# Altium project Sensor.PrjPcb
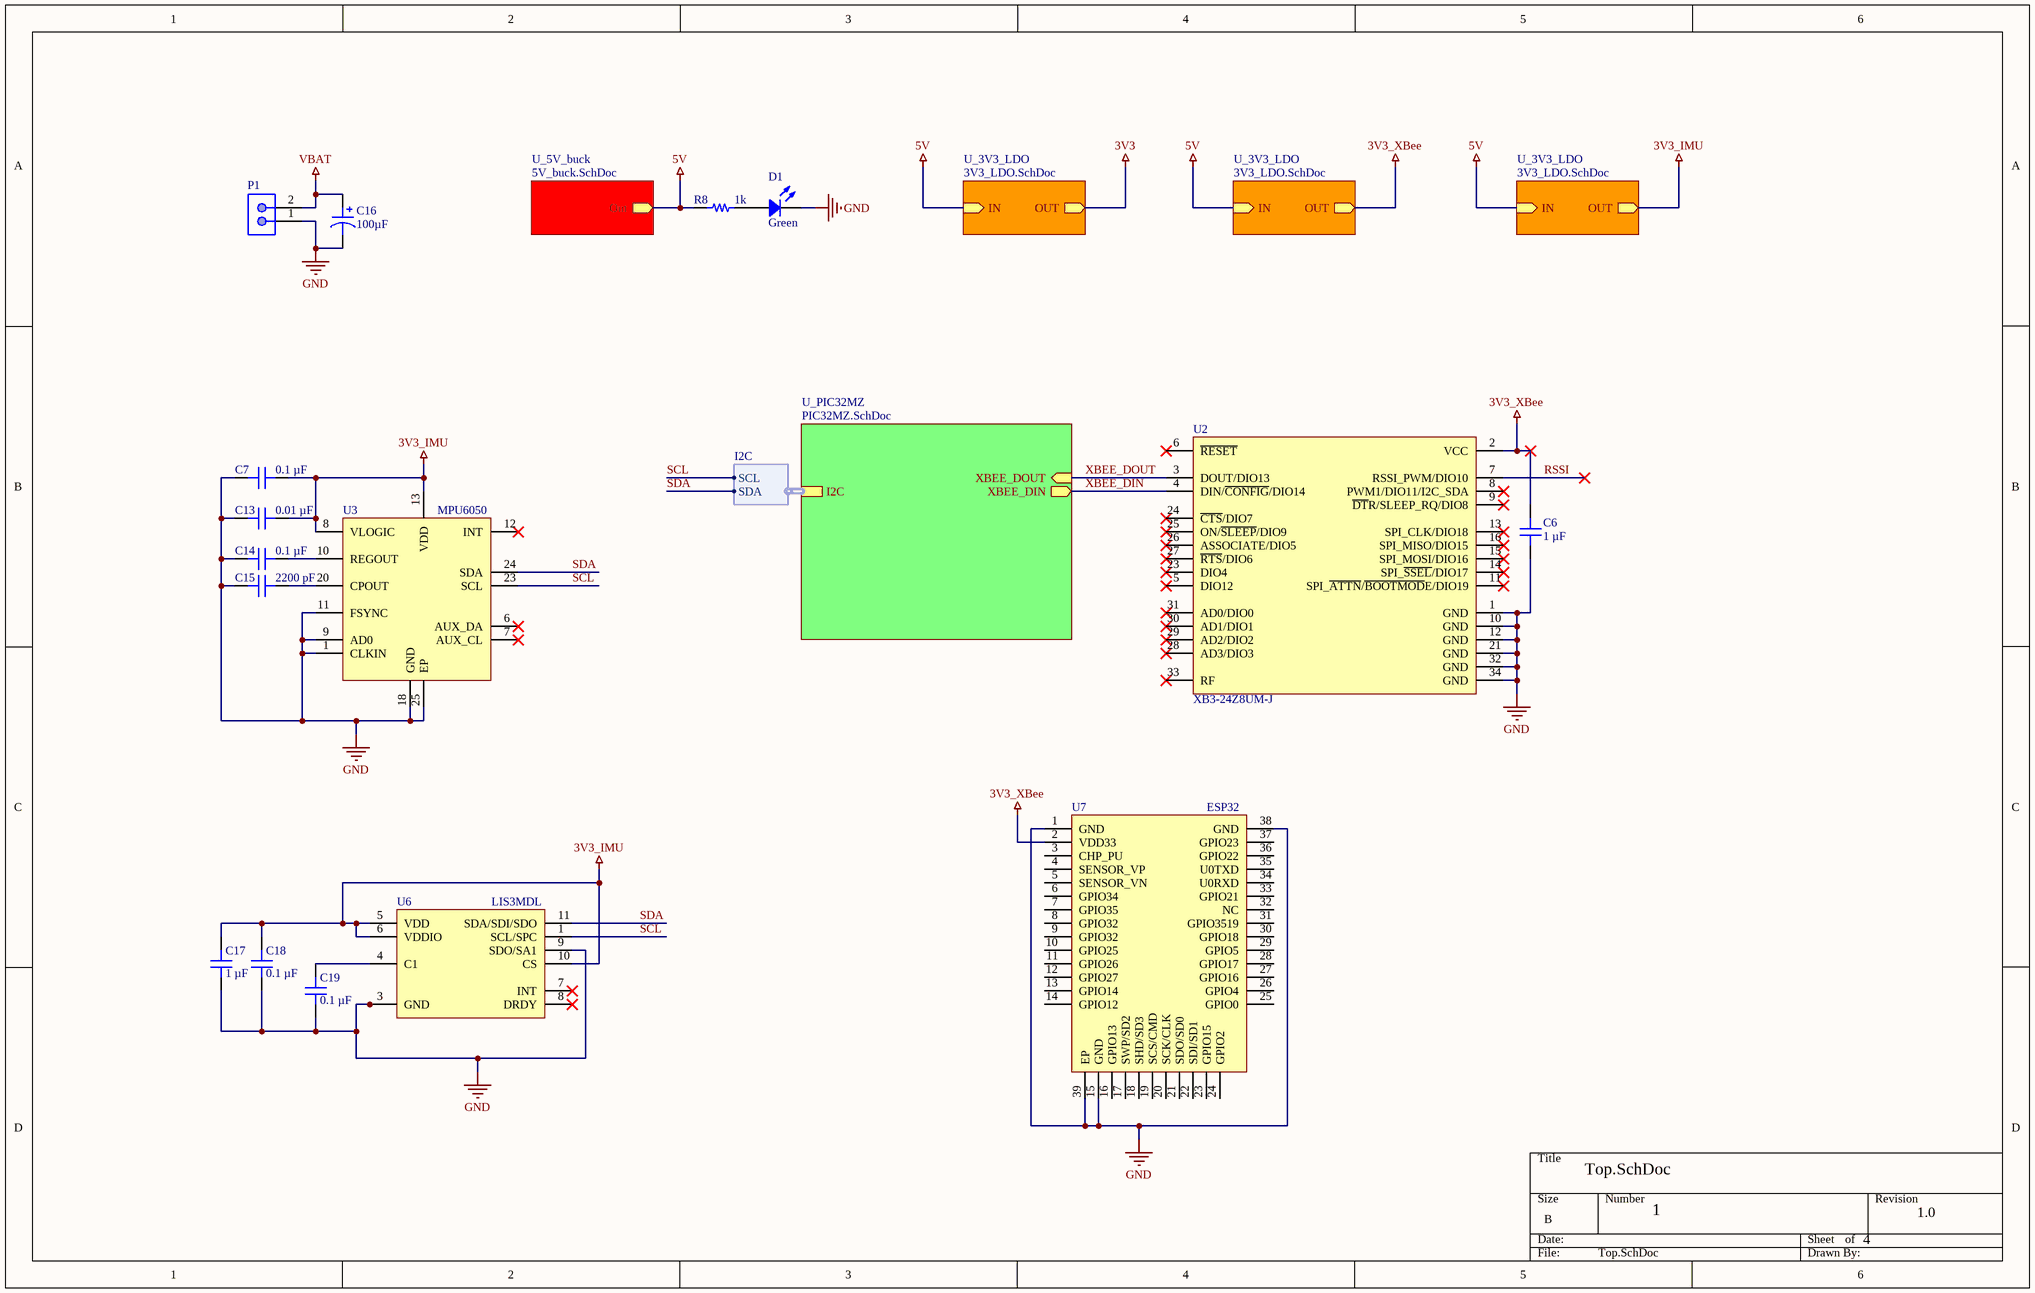
[diagram p0: Top.SchDoc]
ProjectRevision: 1.0
4 sheets, 57 parts. Net scope: hierarchical (ports join the sheet entries above them; power ports are global).
Board file: Sensor.PcbDoc
Sheets:
  Top.SchDoc
    U_PIC32MZ = PIC32MZ.SchDoc
    U_5V_buck = 5V_buck.SchDoc
    U_3V3_LDO = 3V3_LDO.SchDoc
    U_3V3_LDO = 3V3_LDO.SchDoc
    U_3V3_LDO = 3V3_LDO.SchDoc

## Sheet Top.SchDoc
size B; SheetNumber: 1; SheetTotal: 4

### Parts
C6  1 µF  [CAP 0402_1005]
C7  0.1 µF  [CAP 0402_1005]
C13  0.01 µF  [CAP 0402_1005]
C14  0.1 µF  [CAP 0402_1005]
C15  2200 pF  [CAP 0402_1005]
C16  100µF  [CAP POL 2917_7343]
C17  1 µF  [CAP 0402_1005]
C18  0.1 µF  [CAP 0402_1005]
C19  0.1 µF  [CAP 0402_1005]
D1  Green  [LED 0603_1608 GREEN]
P1  2 pin 2mm JST Male  [2pin - 2mm JST male]  (value not drawn)
R8  1k  [RES 0402_1005]
U2  XB3-24Z8UM-J  [XCVR_XB3-24Z8UM-J]
U3  MPU6050  [IC_MPU6050]
U6  LIS3MDL  [LGA12_ST]
U7  ESP32  [Espressif ESP32-WROOM-32]

### Sub-sheets
U_3V3_LDO = 3V3_LDO.SchDoc: OUT (out), IN (in)
U_3V3_LDO = 3V3_LDO.SchDoc: OUT (out), IN (in)
U_3V3_LDO = 3V3_LDO.SchDoc: OUT (out), IN (in)
U_5V_buck = 5V_buck.SchDoc: Out (out)
U_PIC32MZ = PIC32MZ.SchDoc: XBEE_DIN (out), XBEE_DOUT (in), I2C (harness I2C)

### Harnesses
I2C: SCL, SDA

### Nets
3V3_IMU: C7.1 C13.1 C17.1 C18.1 U3.8(VLOGIC) U3.13(VDD) U6.5(VDD) U6.6(VDDIO) U6.10(CS) ; sheet U_3V3_LDO/OUT
3V3_XBee: C6.1 U2.2(VCC) U7.2(VDD33) ; sheet U_3V3_LDO/OUT
5V: R8.1 ; sheet U_5V_buck/Out, sheet U_3V3_LDO/IN, sheet U_3V3_LDO/IN, sheet U_3V3_LDO/IN
GND: C6.2 C7.2 C13.2 C14.2 C15.2 C16.2 C17.2 C18.2 C19.2 D1.2 P1.1 U2.1(GND) U2.10(GND) U2.12(GND) U2.21(GND) U2.32(GND) U2.34(GND) U3.1(CLKIN) U3.9(AD0) U3.11(FSYNC) U3.18(GND) U3.25(EP) U6.2(Reserved) U6.3(GND) U6.9(SDO/SA1) U6.12(Reserved) U7.1(GND) U7.15(GND) U7.38(GND) U7.39(EP)
VBAT: C16.1 P1.2
RSSI: U2.7(RSSI_PWM/DIO10)
SCL: U3.23(SCL) U6.1(SCL/SPC) ; sheet U_PIC32MZ/I2C.SCL
SDA: U3.24(SDA) U6.11(SDA/SDI/SDO) ; sheet U_PIC32MZ/I2C.SDA
XBEE_DIN: U2.4(DIN/~{CONFIG}/DIO14) ; sheet U_PIC32MZ/XBEE_DIN
XBEE_DOUT: U2.3(DOUT/DIO13) ; sheet U_PIC32MZ/XBEE_DOUT
NetC14_1: C14.1 U3.10(REGOUT)
NetC15_1: C15.1 U3.20(CPOUT)
NetC19_1: C19.1 U6.4(C1)
NetD1_1: D1.1 R8.2

Not connected (* = marked no-connect by the designer): U2 5(DIO12)* 6(~{RESET})* 8(PWM1/DIO11/I2C_SDA)* 9(~{DT}R/SLEEP_RQ/DIO8)* 11(SPI_~{ATTN}/~{BOOTMOD}E/DIO19)* 13(SPI_CLK/DIO18)* 14(SPI_~{SSEL}/DIO17)* 15(SPI_MOSI/DIO16)* 16(SPI_MISO/DIO15)* 23(DIO4)* 24(~{CTS}/DIO7)* 25(ON/~{SLEEP}/DIO9)* 26(ASSOCIATE/DIO5)* 27(~{RTS}/DIO6)* 28(AD3/DIO3)* 29(AD2/DIO2)* 30(AD1/DIO1)* 31(AD0/DIO0)* 33(RF)*; U3 6(AUX_DA)* 7(AUX_CL)* 12(INT)*; U6 7(INT)* 8(DRDY)*; U7 3(CHP_PU) 4(SENSOR_VP) 5(SENSOR_VN) 6(GPIO34) 7(GPIO35) 8(GPIO32) 9(GPIO32) 10(GPIO25) 11(GPIO26) 12(GPIO27) 13(GPIO14) 14(GPIO12) 16(GPIO13) 17(SWP/SD2) 18(SHD/SD3) 19(SCS/CMD) 20(SCK/CLK) 21(SDO/SD0) 22(SDI/SD1) 23(GPIO15) 24(GPIO2) 25(GPIO0) 26(GPIO4) 27(GPIO16) 28(GPIO17) 29(GPIO5) 30(GPIO18) 31(GPIO3519) 32(NC) 33(GPIO21) 34(U0RXD) 35(U0TXD) 36(GPIO22) 37(GPIO23)

### Library data of the parts
C6 C13 C15 C17 = C0402C104K4RACAUTO: CAP CER 0.1UF 16V X7R 0402; manufacturer: KEMET; Capacitance: 0.1 µF; Tolerance: ±10%; Part Number: C0402C104K4RACAUTO; Applications: Automotive, Bypass, Decoupling; componentlink1description: Datasheet; componentlink1url: https://api.kemet.com/component-edge/download/specsheet/C0402C104K4RACAUTO.pdf; componentlink2description: DigiKey Link; componentlink2url: https://www.digikey.com/en/products/detail/kemet/C0402C104K4RACAUTO/3314827; Device Package: 0402 (1005 Metric); lastupdated: 8/14/2022 9:05:51 PM; Lifecycle Status: Active; Minimum Order: 1; Mounting Type: Surface Mount, MLCC; Operating Temperature: -55°C ~ 125°C; Package / Case: 0402 (1005 Metric); packaging: TapeAndReel; partid: 3024; Part Status: Active; price: 0.01; Ratings: AEC-Q200; series: SMD Auto X7R; Size / Dimension: 0.039" L x 0.020" W (1.00mm x 0.50mm); Supplier 1: DigiKey; Supplier Part Number 1: 399-6828-1-ND; Temperature Coefficient: X7R; Thickness (Max): 0.022" (0.55mm); Voltage - Rated: 16V
  C6 C17: Value: 1 µF
  C13: Value: 0.01 µF
  C15: Value: 2200 pF
C7 C14 C18 C19 = C0402C104K4RACAUTO: CAP CER 0.1UF 16V X7R 0402; manufacturer: KEMET; Tolerance: ±10%; Part Number: C0402C104K4RACAUTO; Value: 0.1 µF; Applications: Automotive, Bypass, Decoupling; Capacitance: 0.1 µF; componentlink1description: Datasheet; componentlink1url: https://api.kemet.com/component-edge/download/specsheet/C0402C104K4RACAUTO.pdf; componentlink2description: DigiKey Link; componentlink2url: https://www.digikey.com/en/products/detail/kemet/C0402C104K4RACAUTO/3314827; Device Package: 0402 (1005 Metric); lastupdated: 8/14/2022 9:05:51 PM; Lifecycle Status: Active; Minimum Order: 1; Mounting Type: Surface Mount, MLCC; Operating Temperature: -55°C ~ 125°C; Package / Case: 0402 (1005 Metric); packaging: TapeAndReel; partid: 3024; Part Status: Active; price: 0.01; Ratings: AEC-Q200; series: SMD Auto X7R; Size / Dimension: 0.039" L x 0.020" W (1.00mm x 0.50mm); Supplier 1: DigiKey; Supplier Part Number 1: 399-6828-1-ND; Temperature Coefficient: X7R; Thickness (Max): 0.022" (0.55mm); Voltage - Rated: 16V
C16 = 293D107X0020E2TE3: CAP TANT 100UF 20% 20V 2917; Manufacturer: Vishay Sprague; Manufacturer Size Code: E; ESR (Equivalent Series Resistance): 500mOhm; Type: Molded; Part Number: 293D107X0020E2TE3; Value: 100µF; Capacitance: 100µF; ComponentLink1Description: Datasheet; ComponentLink1URL: http://www.vishay.com/docs/40002/293d.pdf; ComponentLink2Description: DigiKey Link; ComponentLink2URL: http://digikey.com/product-detail/en/vishay-sprague/293D107X0020E2TE3/718-293D107X0020E2TE3CT-ND/10507022; Device Package: 2917 (7343 Metric); Features: General Purpose; Height - Seated (Max): 0.170" (4.32mm); LastUpdated: 13-Aug-20 10:43:35 AM; Lifecycle Status: Active; Minimum Order: 1; Mounting Type: Surface Mount; Operating Temperature: -55°C ~ 125°C; Package / Case: 2917 (7343 Metric); Packaging: TapeAndReel; PartId: 1360; Part Status: Active; Price: 0.70; Series: TANTAMOUNT®, 293D; Size / Dimension: 0.287" L x 0.169" W (7.30mm x 4.30mm); Supplier 1: DigiKey; Supplier Part Number 1: 718-293D107X0020E2TE3CT-ND; Tolerance: ±20%
D1 = XZCDGK53W-8VF: 1.6X0.8MM LC GREEN PIXSOLED DOME; Manufacturer: SunLED; Configuration: Independent; Current - Test: 2mA; Lens Color: Colorless; Lens Size: 0.35mm Dia; Lens Style: Round with Domed Top; Lens Transparency: Clear; Millicandela Rating: 417mcd; Viewing Angle: 60°; Voltage - Forward (Vf) (Typ): 2.65V; Wavelength - Dominant: 525nm; Wavelength - Peak: 515nm; Part Number: XZCDGK53W-8VF; Color: Green; ComponentLink1Description: Datasheet; ComponentLink1URL: https://www.sunledusa.com/products/spec/XZCDGK53W-8VF.pdf; ComponentLink2Description: DigiKey Link; ComponentLink2URL: http://digikey.com/product-detail/en/sunled/XZCDGK53W-8VF/1497-XZCDGK53W-8VFCT-ND/10449792; Device Package: 0603 (1608 Metric); Height (Max): 1.10mm; LastUpdated: 21-Jan-20 3:12:09 AM; Lifecycle Status: Active; Minimum Order: 1; Mounting Type: Surface Mount; Package / Case: 0603 (1608 Metric); Packaging: Unknown; PartId: 938; Part Status: Active; Price: 0.18; Series: Ultra Low Current; Size / Dimension: 1.60mm L x 0.80mm W; Supplier 1: DigiKey; Supplier Part Number 1: 1497-XZCDGK53W-8VFCT-ND; Supplier Device Package: 2-SMD; Value: Green
R8 = RK73H1ETTP1432F: RES 14.3K OHM 1% 1/10W 0402; Manufacturer: KOA Speer Electronics, Inc.; Power (Watts): 0.1W, 1/10W; Resistance: 14.3 kOhms; Temperature Coefficient: ±100ppm/°C; Part Number: RK73H1ETTP1432F; Value: 1k; ComponentLink1Description: Datasheet; ComponentLink1URL: http://www.koaspeer.com/catimages/Products/RK73H/RK73H.pdf; ComponentLink2Description: DigiKey Link; ComponentLink2URL: https://www.digikey.com/en/products/detail/koa-speer-electronics-inc/RK73H1ETTP1432F/9844351; Composition: Thick Film; Device Package: 0402 (1005 Metric); Features: Automotive AEC-Q200, Moisture Resistant; Height - Seated (Max): 0.016" (0.40mm); LastUpdated: 8/14/2022 9:23:49 PM; Lifecycle Status: Active; Minimum Order: 1; Number of Terminations: 2; Operating Temperature: -55°C ~ 155°C; Package / Case: 0402 (1005 Metric); Packaging: CutTape; PartId: 10193; Part Status: Active; Price: 0.01; Ratings: AEC-Q200; Series: RK73H; Size / Dimension: 0.039" L x 0.020" W (1.00mm x 0.50mm); Supplier 1: DigiKey; Supplier Part Number 1: 2019-RK73H1ETTP1432FCT-ND; Supplier Device Package: 0402; Tolerance: ±1%
U2 = XB3-24Z8UM-J: 802.15.4 Zigbee Transceiver Module 2.4GHz Antenna Not Included, U.FL Surface Mount; MF: Digi International; Availability: Unavailable; MP: XB3-24Z8UM-J; Value: *; SnapEDA_Link: https://www.snapeda.com/parts/XB3-24Z8UM-J/Digi%20International/view-part/2762908/?ref=snap; Price: None; Package: SMD-34 Digi International
U6 = LIS3MDL: Magnetometer

## Sheet PIC32MZ.SchDoc
size B; SheetNumber: 2; SheetTotal: 4
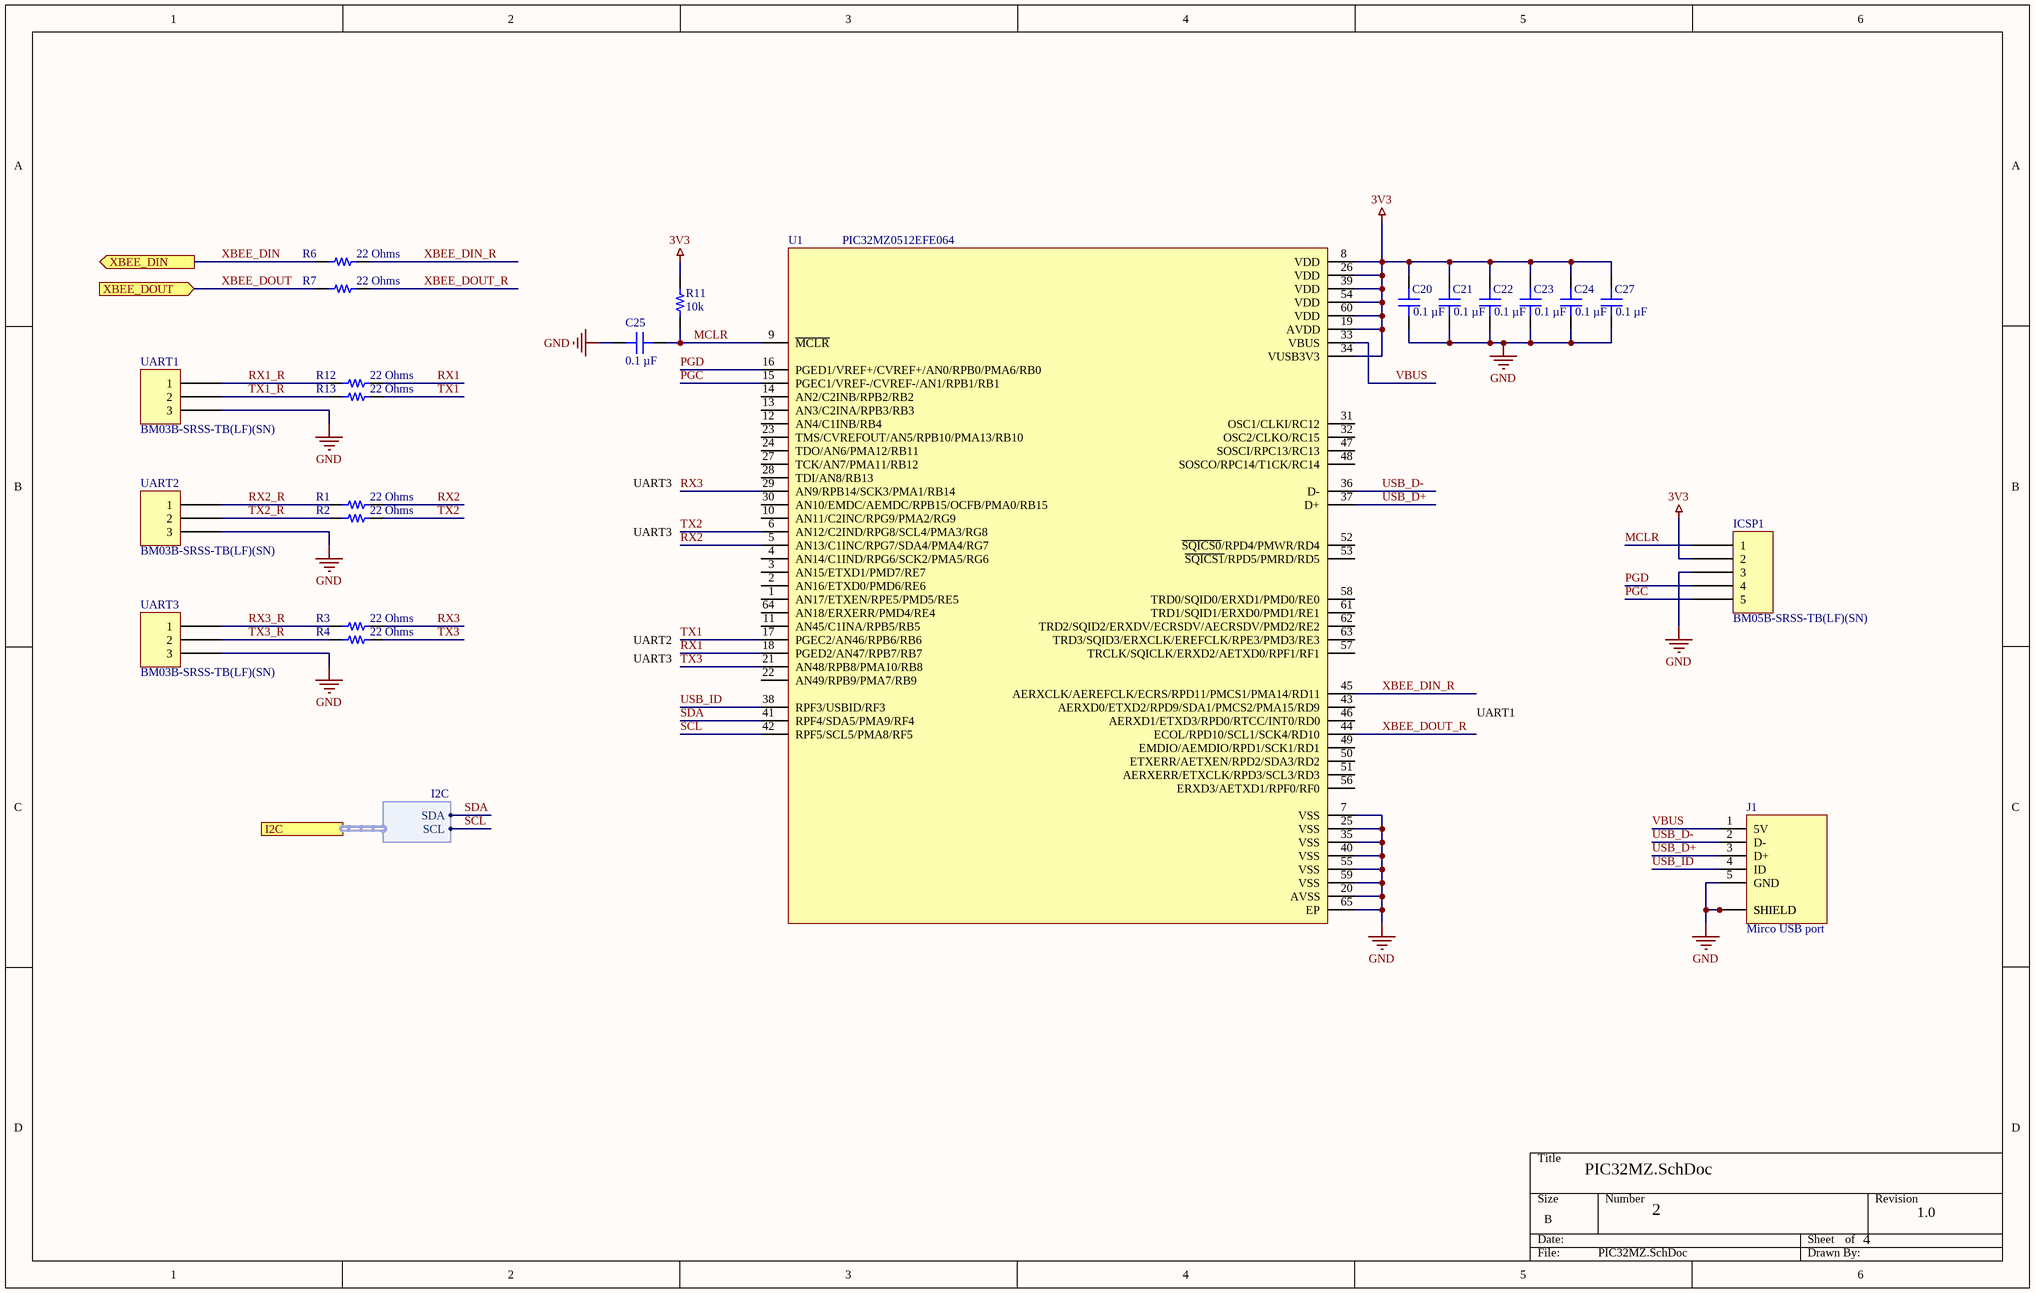
[diagram p1: PIC32MZ.SchDoc]

### Parts
C20  0.1 µF  [CAP 0402_1005]
C21  0.1 µF  [CAP 0402_1005]
C22  0.1 µF  [CAP 0402_1005]
C23  0.1 µF  [CAP 0402_1005]
C24  0.1 µF  [CAP 0402_1005]
C25  0.1 µF  [CAP 0402_1005]
C27  0.1 µF  [CAP 0402_1005]
ICSP1  BM05B-SRSS-TB(LF)(SN)  [JST BM05B-SRSS-TB]
J1  Mirco USB port  [AMPHENOL_10118194-0001LF]
R1  22 Ohms  [RES 0402_1005]
R2  22 Ohms  [RES 0402_1005]
R3  22 Ohms  [RES 0402_1005]
R4  22 Ohms  [RES 0402_1005]
R6  22 Ohms  [RES 0402_1005]
R7  22 Ohms  [RES 0402_1005]
R11  10k  [RES 0402_1005]
R12  22 Ohms  [RES 0402_1005]
R13  22 Ohms  [RES 0402_1005]
U1  PIC32MZ0512EFE064  [QFN50P900X900X100-65N]
UART1  BM03B-SRSS-TB(LF)(SN)  [JST BM03B-SRSS-TB]
UART2  BM03B-SRSS-TB(LF)(SN)  [JST BM03B-SRSS-TB]
UART3  BM03B-SRSS-TB(LF)(SN)  [JST BM03B-SRSS-TB]

### Ports
I2C (harness I2C), XBEE_DIN (out), XBEE_DOUT (in)

### Harnesses
I2C: SDA, SCL

### Nets
3V3: C20.2 C21.2 C22.2 C23.2 C24.2 C27.2 ICSP1.2 R11.1 U1.8(VDD) U1.19(AVDD) U1.26(VDD) U1.34(VUSB3V3) U1.39(VDD) U1.54(VDD) U1.60(VDD)
GND: C20.1 C21.1 C22.1 C23.1 C24.1 C25.2 C27.1 ICSP1.3 J1.5(GND) J1.S1(SHIELD) J1.S2(SHIELD) J1.S3(SHIELD) J1.S4(SHIELD) J1.S5(SHIELD) J1.S6(SHIELD) U1.7(VSS) U1.20(AVSS) U1.25(VSS) U1.35(VSS) U1.40(VSS) U1.55(VSS) U1.59(VSS) U1.65(EP) UART1.3 UART2.3 UART3.3
MCLR: C25.1 ICSP1.1 R11.2 U1.9(~{MCLR})
PGC: ICSP1.5 U1.15(PGEC1/VREF-/CVREF-/AN1/RPB1/RB1)
PGD: ICSP1.4 U1.16(PGED1/VREF+/CVREF+/AN0/RPB0/PMA6/RB0)
RX1: R12.1 U1.18(PGED2/AN47/RPB7/RB7)
RX1_R: R12.2 UART1.1
RX2: R1.1 U1.5(AN13/C1INC/RPG7/SDA4/PMA4/RG7)
RX2_R: R1.2 UART2.1
RX3: R3.1 U1.29(AN9/RPB14/SCK3/PMA1/RB14)
RX3_R: R3.2 UART3.1
SCL: U1.42(RPF5/SCL5/PMA8/RF5) ; port I2C.SCL
SDA: U1.41(RPF4/SDA5/PMA9/RF4) ; port I2C.SDA
TX1: R13.1 U1.17(PGEC2/AN46/RPB6/RB6)
TX1_R: R13.2 UART1.2
TX2: R2.1 U1.6(AN12/C2IND/RPG8/SCL4/PMA3/RG8)
TX2_R: R2.2 UART2.2
TX3: R4.1 U1.21(AN48/RPB8/PMA10/RB8)
TX3_R: R4.2 UART3.2
USB_D+: J1.3(D+) U1.37(D+)
USB_D-: J1.2(D-) U1.36(D-)
USB_ID: J1.4(ID) U1.38(RPF3/USBID/RF3)
VBUS: J1.1(5V) U1.33(VBUS)
XBEE_DIN: R6.2 ; port XBEE_DIN
XBEE_DIN_R: R6.1 U1.45(AERXCLK/AEREFCLK/ECRS/RPD11/PMCS1/PMA14/RD11)
XBEE_DOUT: R7.2 ; port XBEE_DOUT
XBEE_DOUT_R: R7.1 U1.44(ECOL/RPD10/SCL1/SCK4/RD10)

Not connected (* = marked no-connect by the designer): U1 1(AN17/ETXEN/RPE5/PMD5/RE5) 2(AN16/ETXD0/PMD6/RE6) 3(AN15/ETXD1/PMD7/RE7) 4(AN14/C1IND/RPG6/SCK2/PMA5/RG6) 10(AN11/C2INC/RPG9/PMA2/RG9) 11(AN45/C1INA/RPB5/RB5) 12(AN4/C1INB/RB4) 13(AN3/C2INA/RPB3/RB3) 14(AN2/C2INB/RPB2/RB2) 22(AN49/RPB9/PMA7/RB9) 23(TMS/CVREFOUT/AN5/RPB10/PMA13/RB10) 24(TDO/AN6/PMA12/RB11) 27(TCK/AN7/PMA11/RB12) 28(TDI/AN8/RB13) 30(AN10/EMDC/AEMDC/RPB15/OCFB/PMA0/RB15) 31(OSC1/CLKI/RC12) 32(OSC2/CLKO/RC15) 43(AERXD0/ETXD2/RPD9/SDA1/PMCS2/PMA15/RD9) 46(AERXD1/ETXD3/RPD0/RTCC/INT0/RD0) 47(SOSCI/RPC13/RC13) 48(SOSCO/RPC14/T1CK/RC14) 49(EMDIO/AEMDIO/RPD1/SCK1/RD1) 50(ETXERR/AETXEN/RPD2/SDA3/RD2) 51(AERXERR/ETXCLK/RPD3/SCL3/RD3) 52(~{SQICS0}/RPD4/PMWR/RD4) 53(~{SQICS1}/RPD5/PMRD/RD5) 56(ERXD3/AETXD1/RPF0/RF0) 57(TRCLK/SQICLK/ERXD2/AETXD0/RPF1/RF1) 58(TRD0/SQID0/ERXD1/PMD0/RE0) 61(TRD1/SQID1/ERXD0/PMD1/RE1) 62(TRD2/SQID2/ERXDV/ECRSDV/AECRSDV/PMD2/RE2) 63(TRD3/SQID3/ERXCLK/EREFCLK/RPE3/PMD3/RE3) 64(AN18/ERXERR/PMD4/RE4)

### Notes on the sheet
- UART3
- UART2
- UART1

### Library data of the parts
C20-C25 C27 = C0402C104K4RACAUTO: as C7 on sheet Top; Part Number: C0402C104K4RACAUTO; Value: 0.1 µF; Applications: Automotive, Bypass, Decoupling; Capacitance: 0.1 µF; componentlink1description: Datasheet; componentlink1url: https://api.kemet.com/component-edge/download/specsheet/C0402C104K4RACAUTO.pdf; componentlink2description: DigiKey Link; componentlink2url: https://www.digikey.com/en/products/detail/kemet/C0402C104K4RACAUTO/3314827; Device Package: 0402 (1005 Metric); lastupdated: 8/14/2022 9:05:51 PM; Lifecycle Status: Active; Minimum Order: 1; Mounting Type: Surface Mount, MLCC; Operating Temperature: -55°C ~ 125°C; Package / Case: 0402 (1005 Metric); packaging: TapeAndReel; partid: 3024; Part Status: Active; price: 0.01; Ratings: AEC-Q200; series: SMD Auto X7R; Size / Dimension: 0.039" L x 0.020" W (1.00mm x 0.50mm); Supplier 1: DigiKey; Supplier Part Number 1: 399-6828-1-ND; Temperature Coefficient: X7R; Thickness (Max): 0.022" (0.55mm); Voltage - Rated: 16V
ICSP1 = BM05B-SRSS-TB(LF)(SN): CONN HEADER SMD 5POS 1MM; Manufacturer: JST Sales America Inc.; Current Rating (Amps): 0.7A; Material Flammability Rating: UL94 V-0; Number of Positions: 5; Number of Positions Loaded: All; Pitch - Mating: 0.039" (1.00mm); Shrouding: Shrouded - 4 Wall; Style: Board to Cable/Wire; Voltage Rating: 50V; Part Number: BM05B-SRSS-TB(LF)(SN); ComponentLink1Description: Datasheet; ComponentLink1URL: http://www.jst-mfg.com/product/pdf/eng/eSR.pdf; ComponentLink2Description: DigiKey Link; ComponentLink2URL: http://digikey.com/product-detail/en/jst-sales-america-inc/BM05B-SRSS-TB-LF-SN/455-1791-1-ND/926862; Connector Type: Header; Contact Finish - Mating: Tin; Contact Finish - Post: Tin; Contact Material: Copper Alloy; Contact Shape: Square; Contact Type: Male Pin; Fastening Type: Push-Pull; Features: Solder Retention; Insulation Color: Natural; Insulation Height: 0.167" (4.25mm); Insulation Material: Polyamide (PA), Nylon; LastUpdated: 1/12/2020 10:14:00 PM; Lifecycle Status: Active; Minimum Order: 1; Mounting Type: Surface Mount; Number of Rows: 1; Operating Temperature: -25°C ~ 85°C; Packaging: TapeAndReel; PartId: 18; Part Status: Active; Price: 0.35; Series: SR; Supplier 1: DigiKey; Supplier Part Number 1: 455-1791-1-ND; Termination: Solder
J1 = 10118194-0001LF: USB - micro B USB 2.0 Receptacle Connector 5 Position Surface Mount, Right Angle; Through Hole; MF: Amphenol ICC; Package: None; Price: None; Availability: Unavailable; MP: 10118194-0001LF; SnapEDA_Link: https://www.snapeda.com/parts/10118194-0001LF/Amphenol%20FCI/view-part/1413308/?ref=snap; Value: *
R1-R4 R6 R7 R11-R13 = RK73H1ETTP1432F: as R8 on sheet Top; Part Number: RK73H1ETTP1432F; ComponentLink1Description: Datasheet; ComponentLink1URL: http://www.koaspeer.com/catimages/Products/RK73H/RK73H.pdf; ComponentLink2Description: DigiKey Link; ComponentLink2URL: https://www.digikey.com/en/products/detail/koa-speer-electronics-inc/RK73H1ETTP1432F/9844351; Composition: Thick Film; Device Package: 0402 (1005 Metric); Features: Automotive AEC-Q200, Moisture Resistant; Height - Seated (Max): 0.016" (0.40mm); LastUpdated: 8/14/2022 9:23:49 PM; Lifecycle Status: Active; Minimum Order: 1; Number of Terminations: 2; Operating Temperature: -55°C ~ 155°C; Package / Case: 0402 (1005 Metric); Packaging: CutTape; PartId: 10193; Part Status: Active; Price: 0.01; Ratings: AEC-Q200; Series: RK73H; Size / Dimension: 0.039" L x 0.020" W (1.00mm x 0.50mm); Supplier 1: DigiKey; Supplier Part Number 1: 2019-RK73H1ETTP1432FCT-ND; Supplier Device Package: 0402; Tolerance: ±1%
  R1-R4 R6 R7 R12 R13: Value: 22 Ohms
  R11: Value: 10k
U1 = PIC32MZ0512EFE064-I/PT: 32-bit Microcontrollers - MCU 32-BIT MCU 512KB FL 128KB RAM, No Crypto; MF: Microchip; MP: PIC32MZ2048EFG064T-I/PT; Price: None; Value: *; SnapEDA_Link: https://www.snapeda.com/parts/PIC32MZ2048EFG064T-I/PT/Microchip/view-part/565997/?ref=snap; Package: TQFP-64 Microchip; Availability: Unavailable
UART1-UART3 = BM03B-SRSS-TB(LF)(SN): CONN HEADER SMD 3POS 1MM; Manufacturer: JST Sales America Inc.; Current Rating (Amps): 0.7A; Material Flammability Rating: UL94 V-0; Number of Positions: 3; Number of Positions Loaded: All; Pitch - Mating: 0.039" (1.00mm); Shrouding: Shrouded - 4 Wall; Style: Board to Cable/Wire; Voltage Rating: 50V; Part Number: BM03B-SRSS-TB(LF)(SN); ComponentLink1Description: Datasheet; ComponentLink1URL: http://www.jst-mfg.com/product/pdf/eng/eSR.pdf; ComponentLink2Description: DigiKey Link; ComponentLink2URL: http://digikey.com/product-detail/en/jst-sales-america-inc/BM03B-SRSS-TB-LF-SN/455-1789-1-ND/926860; Connector Type: Header; Contact Finish - Mating: Tin; Contact Finish - Post: Tin; Contact Material: Copper Alloy; Contact Shape: Square; Contact Type: Male Pin; Fastening Type: Push-Pull; Features: Solder Retention; Insulation Color: Natural; Insulation Height: 0.167" (4.25mm); Insulation Material: Polyamide (PA), Nylon; LastUpdated: 1/12/2020 10:12:14 PM; Lifecycle Status: Active; Minimum Order: 1; Mounting Type: Surface Mount; Number of Rows: 1; Operating Temperature: -25°C ~ 85°C; Packaging: TapeAndReel; PartId: 14; Part Status: Active; Price: 0.24; Series: SR; Supplier 1: DigiKey; Supplier Part Number 1: 455-1789-1-ND; Termination: Solder

## Sheet 5V_buck.SchDoc
size B; SheetNumber: 4; SheetTotal: 4
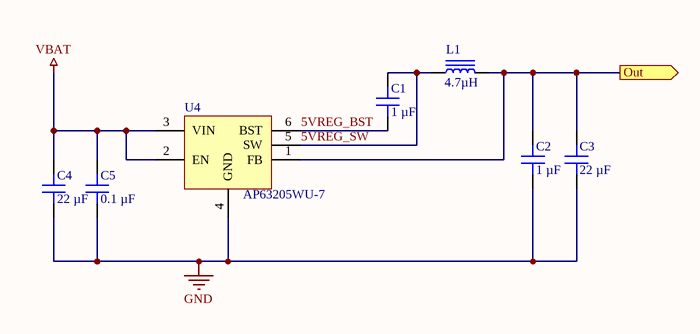
[diagram p2: 5V_buck.SchDoc]

### Parts
C1  1 µF  [CAP 0402_1005]
C2  1 µF  [CAP 0402_1005]
C3  22 µF  [CAP 0402_1005]
C4  22 µF  [CAP 0603_1608]
C5  0.1 µF  [CAP 0402_1005]
L1  4.7µH  [IND 1008_2520]
U4  AP63205WU-7  [TSOT-26-6 - 3.2mm]

### Ports
Out (out)

### Nets
5V: C2.2 C3.2 L1.2 U4.1(FB) ; port Out
GND: C2.1 C3.1 C4.1 C5.1 U4.4(GND)
VBAT: C4.2 C5.2 U4.2(EN) U4.3(VIN)
5VREG_BST: C1.1 U4.6(BST)
5VREG_SW: C1.2 L1.1 U4.5(SW)

### Library data of the parts
C1-C3 = C0402C104K4RACAUTO: as C6 on sheet Top; Part Number: C0402C104K4RACAUTO; Applications: Automotive, Bypass, Decoupling; componentlink1description: Datasheet; componentlink1url: https://api.kemet.com/component-edge/download/specsheet/C0402C104K4RACAUTO.pdf; componentlink2description: DigiKey Link; componentlink2url: https://www.digikey.com/en/products/detail/kemet/C0402C104K4RACAUTO/3314827; Device Package: 0402 (1005 Metric); lastupdated: 8/14/2022 9:05:51 PM; Lifecycle Status: Active; Minimum Order: 1; Mounting Type: Surface Mount, MLCC; Operating Temperature: -55°C ~ 125°C; Package / Case: 0402 (1005 Metric); packaging: TapeAndReel; partid: 3024; Part Status: Active; price: 0.01; Ratings: AEC-Q200; series: SMD Auto X7R; Size / Dimension: 0.039" L x 0.020" W (1.00mm x 0.50mm); Supplier 1: DigiKey; Supplier Part Number 1: 399-6828-1-ND; Temperature Coefficient: X7R; Thickness (Max): 0.022" (0.55mm); Voltage - Rated: 16V
  C1 C2: Value: 1 µF
  C3: Value: 22 µF
C4 = C0603B476M007T: CAP CER 47UF 6.3V X5R 0603; manufacturer: Holy Stone Enterprise Co., Ltd.; Capacitance: 47 µF; Tolerance: ±20%; Part Number: C0603B476M007T; Value: 22 µF; Applications: SMPS Filtering; componentlink1description: Datasheet; componentlink1url: https://media.digikey.com/pdf/Data%20Sheets/Holy%20Stone/HCC_Series_DS.pdf; componentlink2description: DigiKey Link; componentlink2url: https://www.digikey.com/en/products/detail/holy-stone-enterprise-co-ltd/C0603B476M007T/16895203; Device Package: 0603 (1608 Metric); lastupdated: 2/9/2024 8:09:41 PM; Lifecycle Status: Active; Minimum Order: 1; Mounting Type: Surface Mount, MLCC; Operating Temperature: -55°C ~ 85°C; Package / Case: 0603 (1608 Metric); packaging: TapeAndReel; partid: 48531; Part Status: Active; price: 0.12; series: HCC; Size / Dimension: 0.063" L x 0.031" W (1.60mm x 0.80mm); Supplier 1: DigiKey; Supplier Part Number 1: 4587-C0603B476M007TCT-ND; Temperature Coefficient: X5R; Thickness (Max): 0.039" (1.00mm); Voltage - Rated: 6.3V
C5 = C0402C104K4RACAUTO: as C7 on sheet Top; Part Number: C0402C104K4RACAUTO; Value: 0.1 µF; Applications: Automotive, Bypass, Decoupling; Capacitance: 0.1 µF; componentlink1description: Datasheet; componentlink1url: https://api.kemet.com/component-edge/download/specsheet/C0402C104K4RACAUTO.pdf; componentlink2description: DigiKey Link; componentlink2url: https://www.digikey.com/en/products/detail/kemet/C0402C104K4RACAUTO/3314827; Device Package: 0402 (1005 Metric); lastupdated: 8/14/2022 9:05:51 PM; Lifecycle Status: Active; Minimum Order: 1; Mounting Type: Surface Mount, MLCC; Operating Temperature: -55°C ~ 125°C; Package / Case: 0402 (1005 Metric); packaging: TapeAndReel; partid: 3024; Part Status: Active; price: 0.01; Ratings: AEC-Q200; series: SMD Auto X7R; Size / Dimension: 0.039" L x 0.020" W (1.00mm x 0.50mm); Supplier 1: DigiKey; Supplier Part Number 1: 399-6828-1-ND; Temperature Coefficient: X7R; Thickness (Max): 0.022" (0.55mm); Voltage - Rated: 16V
L1 = MLP2520S4R7ST0S1: FIXED IND 4.7UH 1A 110 MOHM SMD; Manufacturer: TDK Corporation; DC Resistance (DCR): 143mOhm Max; Inductance Frequency - Test: 2MHz; Material - Core: Ferrite; Shielding: Shielded; Tolerance: ±20%; Type: Multilayer; Part Number: MLP2520S4R7ST0S1; ComponentLink1Description: Datasheet; ComponentLink1URL: https://product.tdk.com/info/en/catalog/datasheets/inductor_commercial_power_mlp2520_en.pdf?ref_disty=digikey; ComponentLink2Description: DigiKey Link; ComponentLink2URL: http://digikey.com/product-detail/en/tdk-corporation/MLP2520S4R7ST0S1/445-6378-1-ND/2465705; Current Rating (Amps): 1A; Device Package: 1008 (2520 Metric); Height - Seated (Max): 0.039" (1.00mm); Inductance: 4.7µH; LastUpdated: 13-Aug-20 11:03:40 AM; Lifecycle Status: Active; Minimum Order: 1; Mounting Type: Surface Mount; Operating Temperature: -40°C ~ 125°C; Package / Case: 1008 (2520 Metric); Packaging: TapeAndReel; PartId: 3467; Part Status: Active; Price: 0.14; Series: MLP; Size / Dimension: 0.098" L x 0.079" W (2.50mm x 2.00mm); Supplier 1: DigiKey; Supplier Part Number 1: 445-6378-1-ND; Supplier Device Package: 1008 (2520 Metric); Value: 4.7µH
U4 = AP63205WU-7: 5V fixed step down Buck

## Sheet 3V3_LDO.SchDoc
size B; SheetNumber: 3; SheetTotal: 4
Used 3 times, as channels U_3V3_LDO, U_3V3_LDO, U_3V3_LDO. Parts and nets are listed once, with the designators drawn on the sheet.
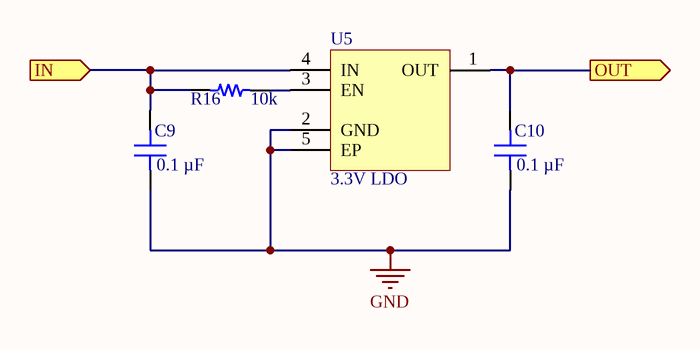
[diagram p3: 3V3_LDO.SchDoc]

### Parts
C9  0.1 µF  [CAP 0402_1005]
C10  0.1 µF  [CAP 0402_1005]
R16  10k  [RES 0402_1005]
U5  3.3V LDO  [XDFN-4]

### Ports
IN (in), OUT (out)

### Nets
GND: C9.1 C10.1 U5.2(GND) U5.5(EP)
IN: C9.2 R16.1 U5.4(IN) ; port IN
OUT: C10.2 U5.1(OUT) ; port OUT
NetR16_2: R16.2 U5.3(EN)

### Channels
U_3V3_LDO: designators end in _3; ports IN=5V OUT=3V3
U_3V3_LDO: designators end in _2; ports IN=5V OUT=3V3_XBee
U_3V3_LDO: designators end in _1; ports IN=5V OUT=3V3_IMU

### Library data of the parts
C9 C10 = C0402C104K4RACAUTO: as C7 on sheet Top; Part Number: C0402C104K4RACAUTO; Value: 0.1 µF; Applications: Automotive, Bypass, Decoupling; Capacitance: 0.1 µF; componentlink1description: Datasheet; componentlink1url: https://api.kemet.com/component-edge/download/specsheet/C0402C104K4RACAUTO.pdf; componentlink2description: DigiKey Link; componentlink2url: https://www.digikey.com/en/products/detail/kemet/C0402C104K4RACAUTO/3314827; Device Package: 0402 (1005 Metric); lastupdated: 8/14/2022 9:05:51 PM; Lifecycle Status: Active; Minimum Order: 1; Mounting Type: Surface Mount, MLCC; Operating Temperature: -55°C ~ 125°C; Package / Case: 0402 (1005 Metric); packaging: TapeAndReel; partid: 3024; Part Status: Active; price: 0.01; Ratings: AEC-Q200; series: SMD Auto X7R; Size / Dimension: 0.039" L x 0.020" W (1.00mm x 0.50mm); Supplier 1: DigiKey; Supplier Part Number 1: 399-6828-1-ND; Temperature Coefficient: X7R; Thickness (Max): 0.022" (0.55mm); Voltage - Rated: 16V
R16 = RP73PF1E5K62BTD: RES 5.62K OHM 0.1% 1/10W 0402; Manufacturer: TE Connectivity Passive Product; Power (Watts): 0.1W, 1/10W; Resistance: 5.62 kOhms; Temperature Coefficient: ±25ppm/°C; Part Number: RP73PF1E5K62BTD; Value: 10k; ComponentLink1Description: Datasheet; ComponentLink1URL: https://www.te.com/commerce/DocumentDelivery/DDEController?Action=srchrtrv&DocNm=1773272&DocType=DS&DocLang=English; ComponentLink2Description: DigiKey Link; ComponentLink2URL: https://www.digikey.com/en/products/detail/te-connectivity-passive-product/RP73PF1E5K62BTD/8260933; Composition: Thin Film; Device Package: 0402 (1005 Metric); Height - Seated (Max): 0.014" (0.35mm); LastUpdated: 2/9/2024 8:30:24 PM; Lifecycle Status: Active; Minimum Order: 1; Number of Terminations: 2; Operating Temperature: -55°C ~ 155°C; Package / Case: 0402 (1005 Metric); Packaging: TapeAndReel; PartId: 2425; Part Status: Active; Price: 0.08; Series: RP73, Holsworthy; Size / Dimension: 0.039" L x 0.020" W (1.00mm x 0.50mm); Supplier 1: DigiKey; Supplier Part Number 1: A127391CT-ND; Supplier Device Package: 0402; Tolerance: ±0.1%
U5 = TLV74033PDQNR

## Nets that join several sheets
3V3: PIC32MZ (15 pins), U_3V3_LDO (C10_3.2 U5_3.1)
3V3_IMU: Top (9 pins), U_3V3_LDO (C10_1.2 U5_1.1)
3V3_XBee: Top (C6.1 U2.2 U7.2), U_3V3_LDO (C10_2.2 U5_2.1)
5V: Top (R8.1), 5V_buck (C2.2 C3.2 L1.2 U4.1), U_3V3_LDO (C9_3.2 R16_3.1 U5_3.4), U_3V3_LDO (C9_2.2 R16_2.1 U5_2.4), U_3V3_LDO (C9_1.2 R16_1.1 U5_1.4)
GND: Top (30 pins), PIC32MZ (26 pins), 5V_buck (5 pins), U_3V3_LDO (C9_3.1 C10_3.1 U5_3.2 U5_3.5), U_3V3_LDO (C9_2.1 C10_2.1 U5_2.2 U5_2.5), U_3V3_LDO (C9_1.1 C10_1.1 U5_1.2 U5_1.5)
VBAT: Top (C16.1 P1.2), 5V_buck (C4.2 C5.2 U4.2 U4.3)
SCL: Top (U3.23 U6.1), PIC32MZ (U1.42)
SDA: Top (U3.24 U6.11), PIC32MZ (U1.41)
XBEE_DIN: Top (U2.4), PIC32MZ (R6.2)
XBEE_DOUT: Top (U2.3), PIC32MZ (R7.2)

## Assembly variants
Main: all parts fitted